# EasyEDA Pro project ProPrj_Arduino_DengDog_2025-10-27.epro

# Schematic Schematic1
Board Name: Board1; Create Date: 2025-10-27; Page Name: P1; Project Name: Arduino_DengDog; Schematic Name: Schematic1; Update Date: 2025-10-27; Company: 嘉立创EDA; Page Size: A2; Version: V1.0
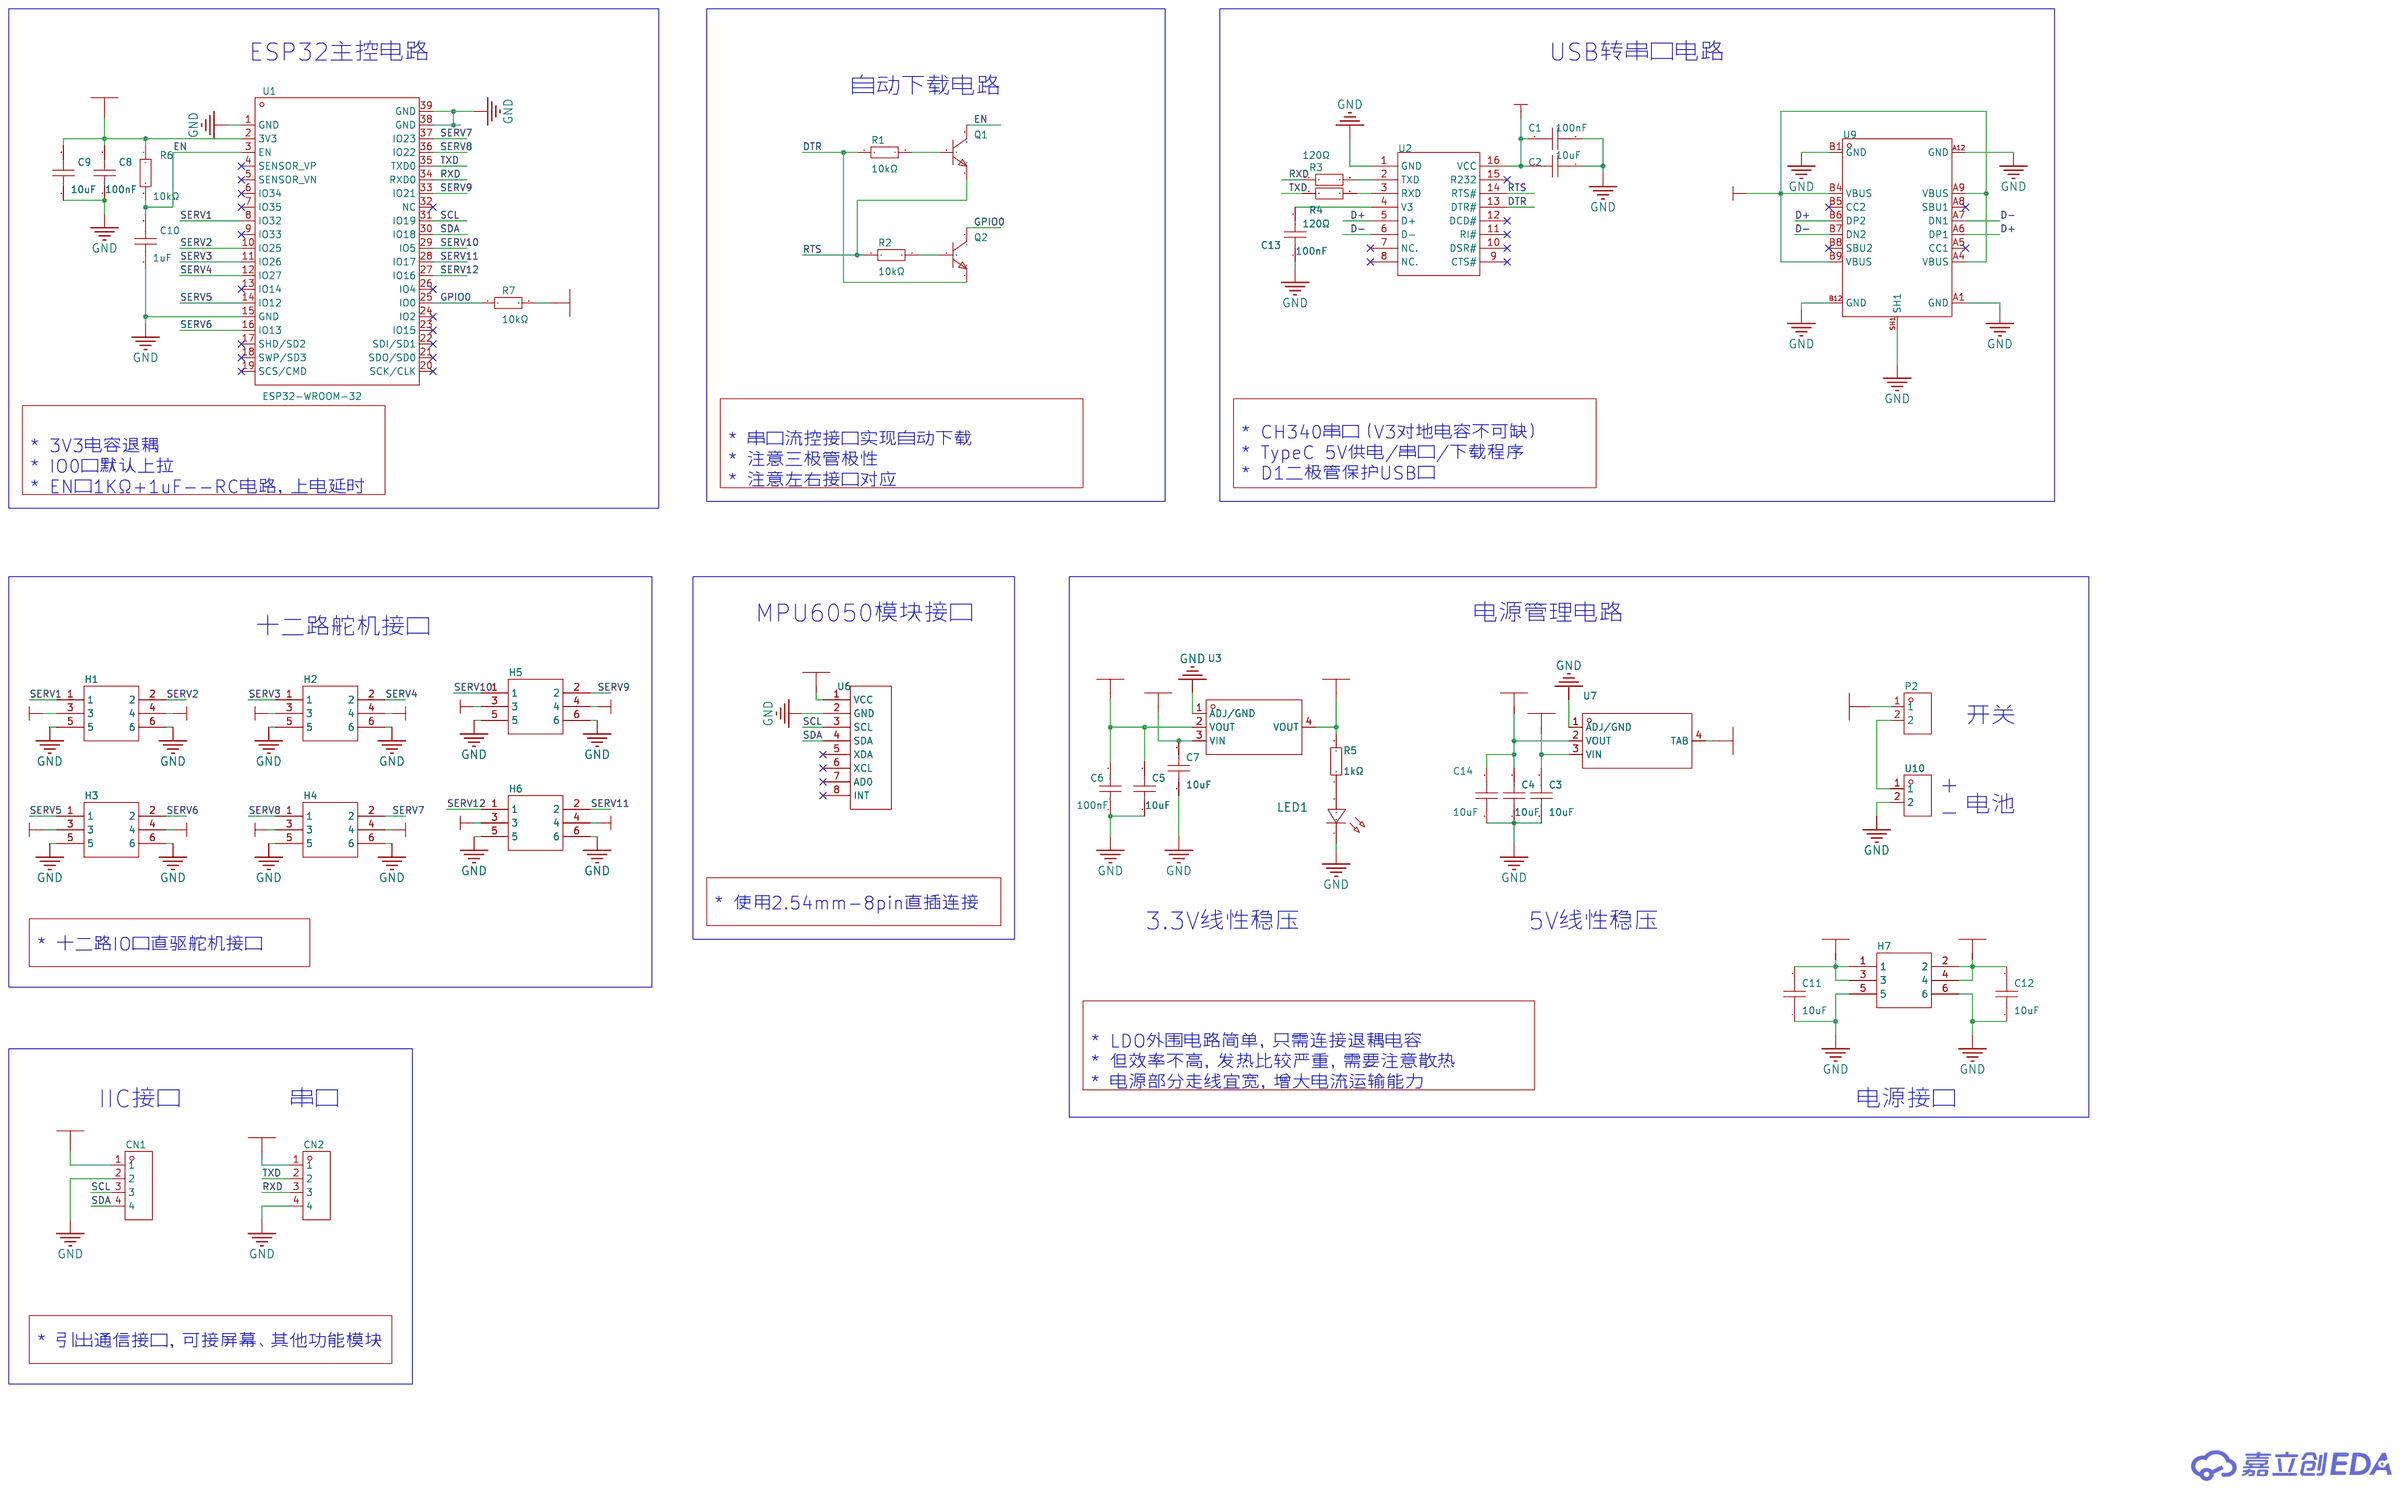
[diagram p0: schematic sheet]

## Parts
C1  100nF  [C0603]
C2  10uF  [C0603]
C3  10uF  [C0603]
C4  10uF  [C0603]
C5  10uF  [C0603]
C6  100nF  [C0603]
C7  10uF  [C0603]
C8  100nF  [C0603]
C9  10uF  [C0603]
C10  1uF  [C0603]
C11  10uF  [C0603]
C12  10uF  [C0603]
C13  100nF  [C0603]
C14  10uF  [C0603]
CN1  A2541WV-4P  [HDR-TH_4P-P2.54-V-M]
CN2  A2541WV-4P  [HDR-TH_4P-P2.54-V-M]
H1  A2541WV-2x3P  [HDR-TH_6P-P2.54-V-R2-C3-S2.54_A2541WV-2X3P]
H2  A2541WV-2x3P  [HDR-TH_6P-P2.54-V-R2-C3-S2.54_A2541WV-2X3P]
H3  A2541WV-2x3P  [HDR-TH_6P-P2.54-V-R2-C3-S2.54_A2541WV-2X3P]
H4  A2541WV-2x3P  [HDR-TH_6P-P2.54-V-R2-C3-S2.54_A2541WV-2X3P]
H5  A2541WV-2x3P  [HDR-TH_6P-P2.54-V-R2-C3-S2.54_A2541WV-2X3P]
H6  A2541WV-2x3P  [HDR-TH_6P-P2.54-V-R2-C3-S2.54_A2541WV-2X3P]
H7  A2541WV-2x3P  [HDR-TH_6P-P2.54-V-R2-C3-S2.54_A2541WV-2X3P]
LED1  19-217/R6C-AL1M2VY/3T  [LED0603-R-RD]
P2  KF301-5.0-2P  [CONN-TH_EK508V-02P]
Q1  2N3904S-RTK/PS  [SOT-23-3_L2.9-W1.3-P1.90-LS2.4-TR]
Q2  2N3904S-RTK/PS  [SOT-23-3_L2.9-W1.3-P1.90-LS2.4-TR]
R1  10kΩ  [R0603]
R2  10kΩ  [R0603]
R3  120Ω  [R0603]
R4  120Ω  [R0603]
R5  1kΩ  [R0603]
R6  10kΩ  [R0603]
R7  10kΩ  [R0603]
U1  ESP32-WROOM-32  [WIFIM-SMD_ESP-32S]
U2  CH340C  [SOP-16_L10.0-W3.9-P1.27-LS6.0-BL]
U3  AMS1117-3.3  [SOT-223-3_L6.5-W3.4-P2.30-LS7.0-BR]
U6  -  [MPU6050]
U7  -  [TO-263-3_L8.6-W10.2-P2.54-LS14.4-TL]
U9  U263-163N-4OS1735  [USB-C-SMD_U263-163N-4GS1735]
U10  KF301-5.0-2P  [CONN-TH_P5.00_KF301-5.0-2P]

## Library data of the parts
C1 C6 C8 C13 = CC0603KRX7R9BB104: 容值:100nF;精度:±10%;额定电压:50V;材质(温度系数):X7R;; LCSC Part Name: 100nF ±10% 50V; Supplier Part: C14663; Manufacturer: YAGEO(国巨); Supplier Footprint: 0603; JLCPCB Part Class: Basic Part; Datasheet: https://atta.szlcsc.com/upload/public/pdf/source/20170116/1484561234239.pdf; Supplier: LCSC; Tolerance: ±10%; Voltage Rated: 50V; Temperature Coefficient: X7R
C2-C5 C7 C9 C11 C12 C14 = CL10A106KP8NNNC: 容值:10uF;精度:±10%;额定电压:10V;材质(温度系数):X5R;; LCSC Part Name: 10uF ±10% 10V; Supplier Part: C19702; Manufacturer: SAMSUNG(三星); Supplier Footprint: 0603; JLCPCB Part Class: Basic Part; Datasheet: https://atta.szlcsc.com/upload/public/pdf/source/20160103/1457707703378.pdf; Supplier: LCSC; Tolerance: ±10%; Voltage Rated: 10V; Temperature Coefficient: X5R
C10 = CL10A105KB8NNNC: 容值:1uF;精度:±10%;额定电压:50V;材质(温度系数):X5R;; LCSC Part Name: 1uF ±10% 50V; Supplier Part: C15849; Manufacturer: SAMSUNG(三星); Supplier Footprint: 0603; JLCPCB Part Class: Basic Part; Datasheet: https://atta.szlcsc.com/upload/public/pdf/source/20160103/1457707679084.pdf; Supplier: LCSC; Tolerance: ±10%; Voltage Rated: 50V; Temperature Coefficient: X5R
CN1 CN2 = A2541WV-4P_1: Supplier Part: C5346656; Manufacturer: CJT(长江连接器); Supplier Footprint: 直插,P=2.54mm; Supplier: LCSC
H1-H7 = A2541WV-2x3P: 间距:2.54mm;总PIN位数:6;排数:2;插针结构:2x3P;行距:2.54mm;安装类型:直插;圆针/方针:方针;额定电流:-;额定电压:-;配合针长度:6mm;塑高:2.54mm;端接针长度:3mm;触头材质:黄铜;触头镀层:-;工作温度范围:-40~+105;颜色:黑色;; LCSC Part Name: 2.54mm 2x3P 直插 方针; Supplier Part: C225518; Manufacturer: CJT(长江连接器); Supplier Footprint: 直插,P=2.54mm; JLCPCB Part Class: Extended Part; Datasheet: https://atta.szlcsc.com/upload/public/pdf/source/20180509/C225518_0BFA6BCCBDAB2EC993D26ADC2A9ADF8C.pdf; Supplier: LCSC; Pitch: 2.54mm; Number of Pins: 6; Number of Rows: 2; Pin Structure: 2x3P; Row Spacing: 2.54mm; Mounting Type: 直插; Circluar Pins/Square Pins: 方针; Length of Mating Pin: 6mm; Insulation Height: 2.54mm; Length of End Connection Pin: 3mm; Contact Material: 黄铜; Operating Temperature Range: -40~+105; Color: 黑色
LED1 = 19-217/R6C-AL1M2VY/3T: 发光颜色:红灯;二极管配置:-;透镜颜色:无色透明;主波长:617.5nm;峰值波长:632nm;色温:-;测试电流:5mA;功率:60mW;发光角度:120°;安装方式:-;工作温度:-40℃~+85℃;; LCSC Part Name: 红灯 617.5nm; Supplier Part: C72044; Manufacturer: EVERLIGHT(亿光); Supplier Footprint: 0603; JLCPCB Part Class: Extended Part; Datasheet: https://atta.szlcsc.com/upload/public/pdf/source/20160507/1462613613821.pdf; Supplier: LCSC; Emitted Color: 红灯; Lens Color: 无色透明; Dominant Wavelength: 617.5nm; Peak Wavelength: 632nm; Forward Current: 5mA; Power Dissipation: 60mW; Viewing Angle: 120°; Operating Temperature: -40℃~+85℃
P2 = KF301-5.0-2P: 间距:5mm;排数:1;每排PIN数:2;安装方式:直针;额定电流:17A;额定电压:250V;线规 - AWG:14~22;线规 - mm?:1.5;工作温度范围:-30℃~+120℃;颜色:蓝色;; LCSC Part Name: 5mm 排数:1 每排P数:2 直针 可拼接 铜 环保; Supplier Part: C474881; Manufacturer: KEFA(科发); Supplier Footprint: 直插,P=5mm; JLCPCB Part Class: Extended Part; Datasheet: https://atta.szlcsc.com/upload/public/pdf/source/20200115/C474881_883EFE2003339C40FD1BEEEFC9A18423.pdf; Supplier: LCSC; Pitch: 5mm; Number of Rows: 1; Number of PINs Per Row: 2; Mounting Style: 直针; Current Rating (Max): 17A; Voltage Rating (Max): 250V; Wire Gauge - AWG: 14~22; Wire Gauge - mm?: 1.5; Operating Temperature Range: -30℃~+120℃; Color: 蓝色
Q1 Q2 = 2N3904S-RTK/PS: 晶体管类型:NPN;集射极击穿电压(Vceo):40V;集电极电流(Ic):200mA;功率(Pd):350mW;集电极截止电流(Icbo):-;集电极-发射极饱和电压(VCE(sat)@Ic,Ib):300mV@50mA,5mA;直流电流增益(hFE@Ic,Vce):100@10mA,1V;特征频率(fT):300MHz;工作温度:+150℃@(Tj);; LCSC Part Name: NPN 40V 200mA; Supplier Part: C18536; Manufacturer: KEC; Supplier Footprint: SOT-23(SOT-23-3); JLCPCB Part Class: Extended Part; Datasheet: https://atta.szlcsc.com/upload/public/pdf/source/20160416/1460799387204.pdf; Supplier: LCSC; Transistor Type: NPN; Collector-Emitter Breakdown Voltage (Vceo): 40V; Collector Current (Ic): 200mA; Power Dissipation (Pd): 350mW; Collector-Emitter Saturation Voltage (VCE(sat)@Ic,Ib): 300mV@50mA,5mA; DC Current Gain (hFE@Ic,Vce): 100@10mA,1V; Transition Frequency (fT): 300MHz; Operating Temperature: +150℃@(Tj); Pin Type: IN
R1 R2 R6 R7 = 0603WAF1002T5E: 电阻类型:厚膜电阻;阻值:10kΩ;精度:±1%;功率:100mW;温度系数:±100ppm/℃;最大工作电压:75V;工作温度范围:-55℃~+155℃;; LCSC Part Name: 10kΩ ±1% 100mW; Supplier Part: C25804; Manufacturer: UNI-ROYAL(厚声); Supplier Footprint: 0603; JLCPCB Part Class: Basic Part; Datasheet: https://atta.szlcsc.com/upload/public/pdf/source/20200306/C422600_1E6D84923E4A46A82E41ADD87F860B5C.pdf; Supplier: LCSC; Type: 厚膜电阻; Tolerance: ±1%; Power(Watts): 100mW; Temperature Coefficient: ±100ppm/℃; Overload Voltage (Max): 75V; Operating Temperature Range: -55℃~+155℃
R3 R4 = 0603WAF1200T5E: 电阻类型:厚膜电阻;阻值:120Ω;精度:±1%;功率:100mW;温度系数:±100ppm/℃;最大工作电压:75V;工作温度范围:-55℃~+155℃;; LCSC Part Name: 120Ω ±1% 100mW; Supplier Part: C22787; Manufacturer: UNI-ROYAL(厚声); Supplier Footprint: 0603; JLCPCB Part Class: Basic Part; Datasheet: https://atta.szlcsc.com/upload/public/pdf/source/20200306/C422600_1E6D84923E4A46A82E41ADD87F860B5C.pdf; Supplier: LCSC; Type: 厚膜电阻; Tolerance: ±1%; Power(Watts): 100mW; Temperature Coefficient: ±100ppm/℃; Overload Voltage (Max): 75V; Operating Temperature Range: -55℃~+155℃
R5 = 0603WAF1001T5E: 电阻类型:厚膜电阻;阻值:1kΩ;精度:±1%;功率:100mW;温度系数:±100ppm/℃;最大工作电压:75V;工作温度范围:-55℃~+155℃;; LCSC Part Name: 1kΩ ±1% 100mW; Supplier Part: C21190; Manufacturer: UNI-ROYAL(厚声); Supplier Footprint: 0603; JLCPCB Part Class: Basic Part; Datasheet: https://atta.szlcsc.com/upload/public/pdf/source/20200306/C422600_1E6D84923E4A46A82E41ADD87F860B5C.pdf; Supplier: LCSC; Type: 厚膜电阻; Tolerance: ±1%; Power(Watts): 100mW; Temperature Coefficient: ±100ppm/℃; Overload Voltage (Max): 75V; Operating Temperature Range: -55℃~+155℃
U1 = ESP32-WROOM-32: Pin Type: IN
U2 = CH340C: 应用功能:Transceiver;接口协议:USB 2.0;数据速率:2Mbps;供电电压:3.3V；5V;; Supplier Part: C84681; Manufacturer: WCH(南京沁恒); Supplier Footprint: SOP-16; JLCPCB Part Class: Extended Part; Datasheet: https://atta.szlcsc.com/upload/public/pdf/source/20200819/C84681_ADBED554CE321879DBD6B1D06488689C.pdf; Supplier: LCSC; Applications Function: Transceiver; Protocol: USB 2.0; Data Rate: 2Mbps; Supply Voltage: 3.3V；5V; Pin Type: IN
U3 = AMS1117-3.3_C6186: 输出类型:固定;输出极性:正;输出通道数:1;最大输入电压:-;输出电压:3.3V;压差:1.3V@(800mA);静态电流(地电流):-;输出电流:1A;电源纹波抑制比(PSRR):72dB@(120Hz);噪声:-;特性:-;工作温度:-;; LCSC Part Name: 正 Vout=3.3V 1A 72dB@(120Hz); Supplier Part: C6186; Manufacturer: AMS; Supplier Footprint: SOT-223-3; JLCPCB Part Class: Basic Part; Datasheet: https://atta.szlcsc.com/upload/public/pdf/source/20180727/C6186_7A095716F0823C02F1997A905E26C086.pdf; Supplier: LCSC; Output Type: 固定; Output Polarity: 正; Number of Outputs: 1; Output Voltage: 3.3V; Dropout Voltage: 1.3V@(800mA); Output Current: 1A; Power Supply Rejection Ratio (PSRR): 72dB@(120Hz); Pin Type: IN
U6 = MPU6050
U7 = LM1084S-5.0/TR: 输出类型:固定;输出极性:正;输出通道数:1;最大输入电压:12V;输出电压:5V;压差:1.5V@(5A);输出电流:5A;电源纹波抑制比(PRSS):72dB@(120Hz);; LCSC Part Name: Vin=12V Vout=5V 5A 72dB@(120Hz); Supplier Part: C259973; Manufacturer: HGSEMI(华冠); Supplier Footprint: TO-263-3L; JLCPCB Part Class: Extended Part; Datasheet: https://atta.szlcsc.com/upload/public/pdf/source/20181026/C259973_D4A8C77477BC653F2A46298C4B478943.pdf; Supplier: LCSC; Output Type: 固定; Output Polarity: 正; Number of Outputs: 1; Maximum Input Voltage: 12V; Output Voltage: 5V; Dropout Voltage: 1.5V@(5A); Output Current: 5A; Power Supply Rejection Ratio (PRSS): 72dB@(120Hz)
U9 = U263-163N-4OS1735: 连接器类型:Type-C;标准:USB 3.1;公母:母座;触点数量:16;端口数量:1;安装方式:卧贴;额定电流 - 电源:5A;触头材质:铜合金;触头镀层:金;工作温度范围:-25℃~+85℃;焊接温度(最大值):260℃;; LCSC Part Name: Type-C 母座 卧贴; Supplier Part: C2931472; Manufacturer: XKB Connectivity(中国星坤); Supplier Footprint: SMD; JLCPCB Part Class: Extended Part; Datasheet: https://atta.szlcsc.com/upload/public/pdf/source/20211215/D777AAC9FA67A227A25094451B68E75F.pdf; Supplier: LCSC; Connector Type: Type-C; Standard: USB 3.1; Gender: 母座; Number of Contacts: 16; Number of Ports: 1; Mounting Style: 卧贴; Current Rating - Power (Max): 5A; Contact Material: 铜合金; Contact Plating: 金; Operating Temperature Range: -25℃~+85℃; Welding Temperature (Max): 260℃
U10 = KF301-5.0-2P: 间距:5mm;排数:1;每排PIN数:2;安装方式:直针;额定电流:17A;额定电压:250V;线规 - AWG:14~22;线规 - mm?:1.5;工作温度范围:-30~+120;颜色:蓝色;; LCSC Part Name: 5mm 排数:1 每排P数:2 直针 可拼接 铜 环保; Supplier Part: C474881; Manufacturer: KEFA(科发); Supplier Footprint: 直插,P=5mm; JLCPCB Part Class: Extended Part; Datasheet: https://atta.szlcsc.com/upload/public/pdf/source/20200115/C474881_883EFE2003339C40FD1BEEEFC9A18423.pdf; Supplier: LCSC; Pitch: 5mm; Number of Rows: 1; Number of PINs Per Row: 2; Mounting Style: 直针; Current Rating (Max): 17A; Voltage Rating (Max): 250V; Wire Gauge - AWG: 14~22; Wire Gauge - mm?: 1.5; Operating Temperature Range: -30~+120; Color: 蓝色

## Nets
3V3: C5.2 C6.2 C8.2 C9.2 C11.2 CN1.1 H7.1 H7.3 R5.2 R6.1 R7.2 U1.2(3V3) U3.2(VOUT) U3.4(VOUT) U6.1(VCC)
5VIN: C1.1 C2.1 C4.2 C7.2 C12.2 C14.2 CN2.1 H1.3 H1.4 H2.3 H2.4 H3.3 H3.4 H4.3 H4.4 H5.3 H5.4 H6.3 H6.4 H7.2 H7.4 U2.16(VCC) U3.3(VIN) U7.2(VOUT) U7.4(TAB) U9.A4(VBUS) U9.A9(VBUS) U9.B4(VBUS) U9.B9(VBUS)
GND: C1.2 C2.2 C3.1 C4.1 C5.1 C6.1 C7.1 C8.1 C9.1 C10.1 C11.1 C12.1 C13.1 C14.1 CN1.2 CN2.4 H1.5 H1.6 H2.5 H2.6 H3.5 H3.6 H4.5 H4.6 H5.5 H5.6 H6.5 H6.6 H7.5 H7.6 LED1.1(C) U1.1(GND) U1.15(GND) U1.38(GND) U1.39(GND) U2.1(GND) U3.1(ADJ/GND) U6.2(GND) U7.1(ADJ/GND) U9.A1(GND) U9.A12(GND) U9.B1(GND) U9.B12(GND) U9.SH1 U10.2
VIN: C3.2 P2.1 U7.3(VIN)
D+: U2.5(D+) U9.A6(DP1) U9.B6(DP2)
D-: U2.6(D-) U9.A7(DN1) U9.B7(DN2)
DTR: Q2.1(E) R1.1 U2.13(DTR#)
EN: C10.2 Q1.3(C) R6.2 U1.3(EN)
GPIO0: Q2.3(C) R7.1 U1.25(IO0)
RTS: Q1.1(E) R2.1 U2.14(RTS#)
RXD: CN2.3 R3.1 U1.34(RXD0)
SCL: CN1.3 U1.31(IO19) U6.3(SCL)
SDA: CN1.4 U1.30(IO18) U6.4(SDA)
SERV1: H1.1 U1.8(IO32)
SERV2: H1.2 U1.10(IO25)
SERV3: H2.1 U1.11(IO26)
SERV4: H2.2 U1.12(IO27)
SERV5: H3.1 U1.14(IO12)
SERV6: H3.2 U1.16(IO13)
SERV7: H4.2 U1.37(IO23)
SERV8: H4.1 U1.36(IO22)
SERV9: H5.2 U1.33(IO21)
SERV10: H5.1 U1.29(IO5)
SERV11: H6.2 U1.28(IO17)
SERV12: H6.1 U1.27(IO16)
TXD: CN2.2 R4.1 U1.35(TXD0)
$1N3534: Q1.2(B) R1.2
$1N3535: Q2.2(B) R2.2
$1N3564: R3.2 U2.2(TXD)
$1N3565: R4.2 U2.3(RXD)
$1N3570: C13.2 U2.4(V3)
Net-(LED1-2): LED1.2(A) R5.1
Net-(P2-2): P2.2 U10.1

Not connected (* = marked no-connect by the designer): U1 4(SENSOR_VP)* 5(SENSOR_VN)* 6(IO34)* 7(IO35)* 9(IO33)* 13(IO14)* 17(SHD/SD2)* 18(SWP/SD3)* 19(SCS/CMD)* 20(SCK/CLK)* 21(SDO/SD0)* 22(SDI/SD1)* 23(IO15)* 24(IO2)* 26(IO4)* 32(NC)*; U2 7(NC.)* 8(NC.)* 9(CTS#)* 10(DSR#)* 11(RI#)* 12(DCD#)* 15(R232)*; U6 5(XDA)* 6(XCL)* 7(AD0)* 8(INT)*; U9 A5(CC1)* A8(SBU1)* B5(CC2)* B8(SBU2)*

## Notes on the sheet
- ESP32主控电路
- USB转串口电路
- 自动下载电路
- * 串口流控接口实现自动下载
  * 注意三极管极性
  * 注意左右接口对应
- * CH340串口（V3对地电容不可缺）
  * TypeC 5V供电/串口/下载程序
  * D1二极管保护USB口
- * 3V3电容退耦
  * IO0口默认上拉
  * EN口1KΩ+1uF--RC电路，上电延时
- MPU6050模块接口
- 电源管理电路
- 十二路舵机接口
- 开关
- +
- -
- 电池
- * 使用2.54mm-8pin直插连接
- 3.3V线性稳压
- 5V线性稳压
- * 十二路IO口直驱舵机接口
- * LDO外围电路简单，只需连接退耦电容
  * 但效率不高，发热比较严重，需要注意散热
  * 电源部分走线宜宽，增大电流运输能力
- IIC接口
- 串口
- 电源接口
- * 引出通信接口，可接屏幕、其他功能模块

# Board PCB1
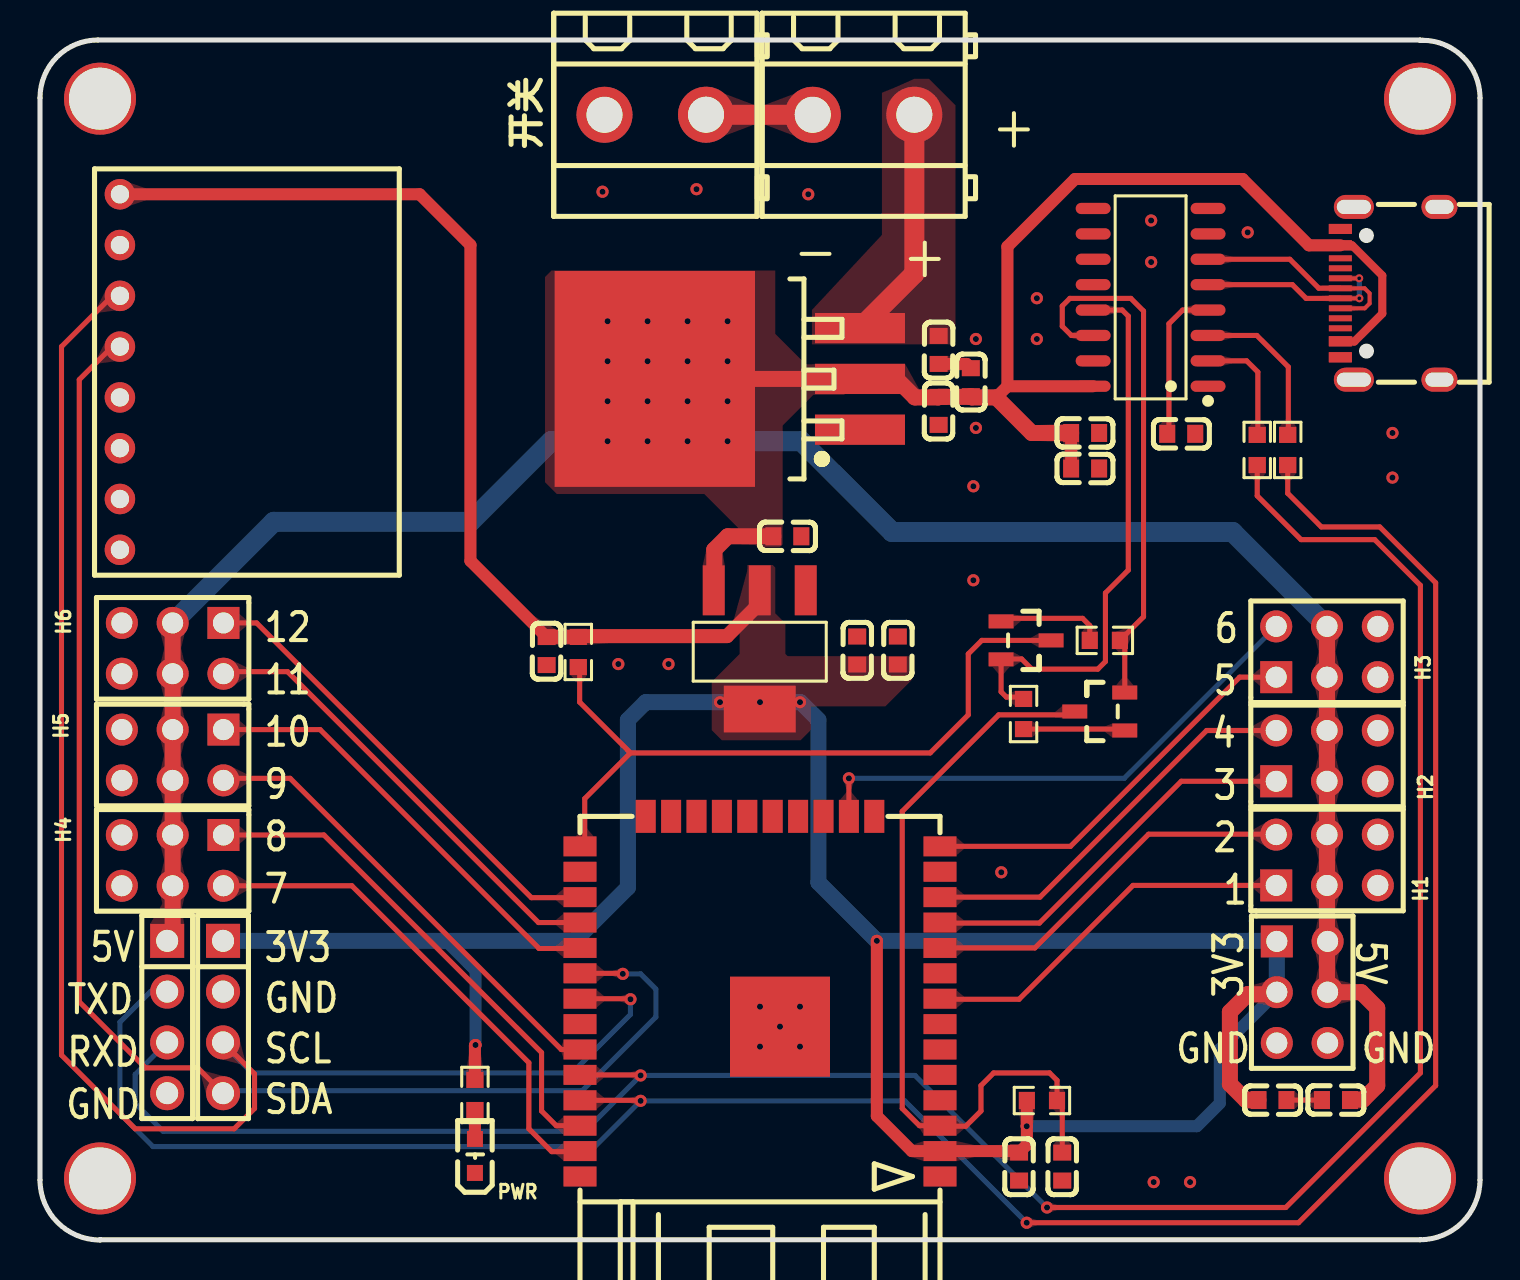
[diagram p1: board, top side]
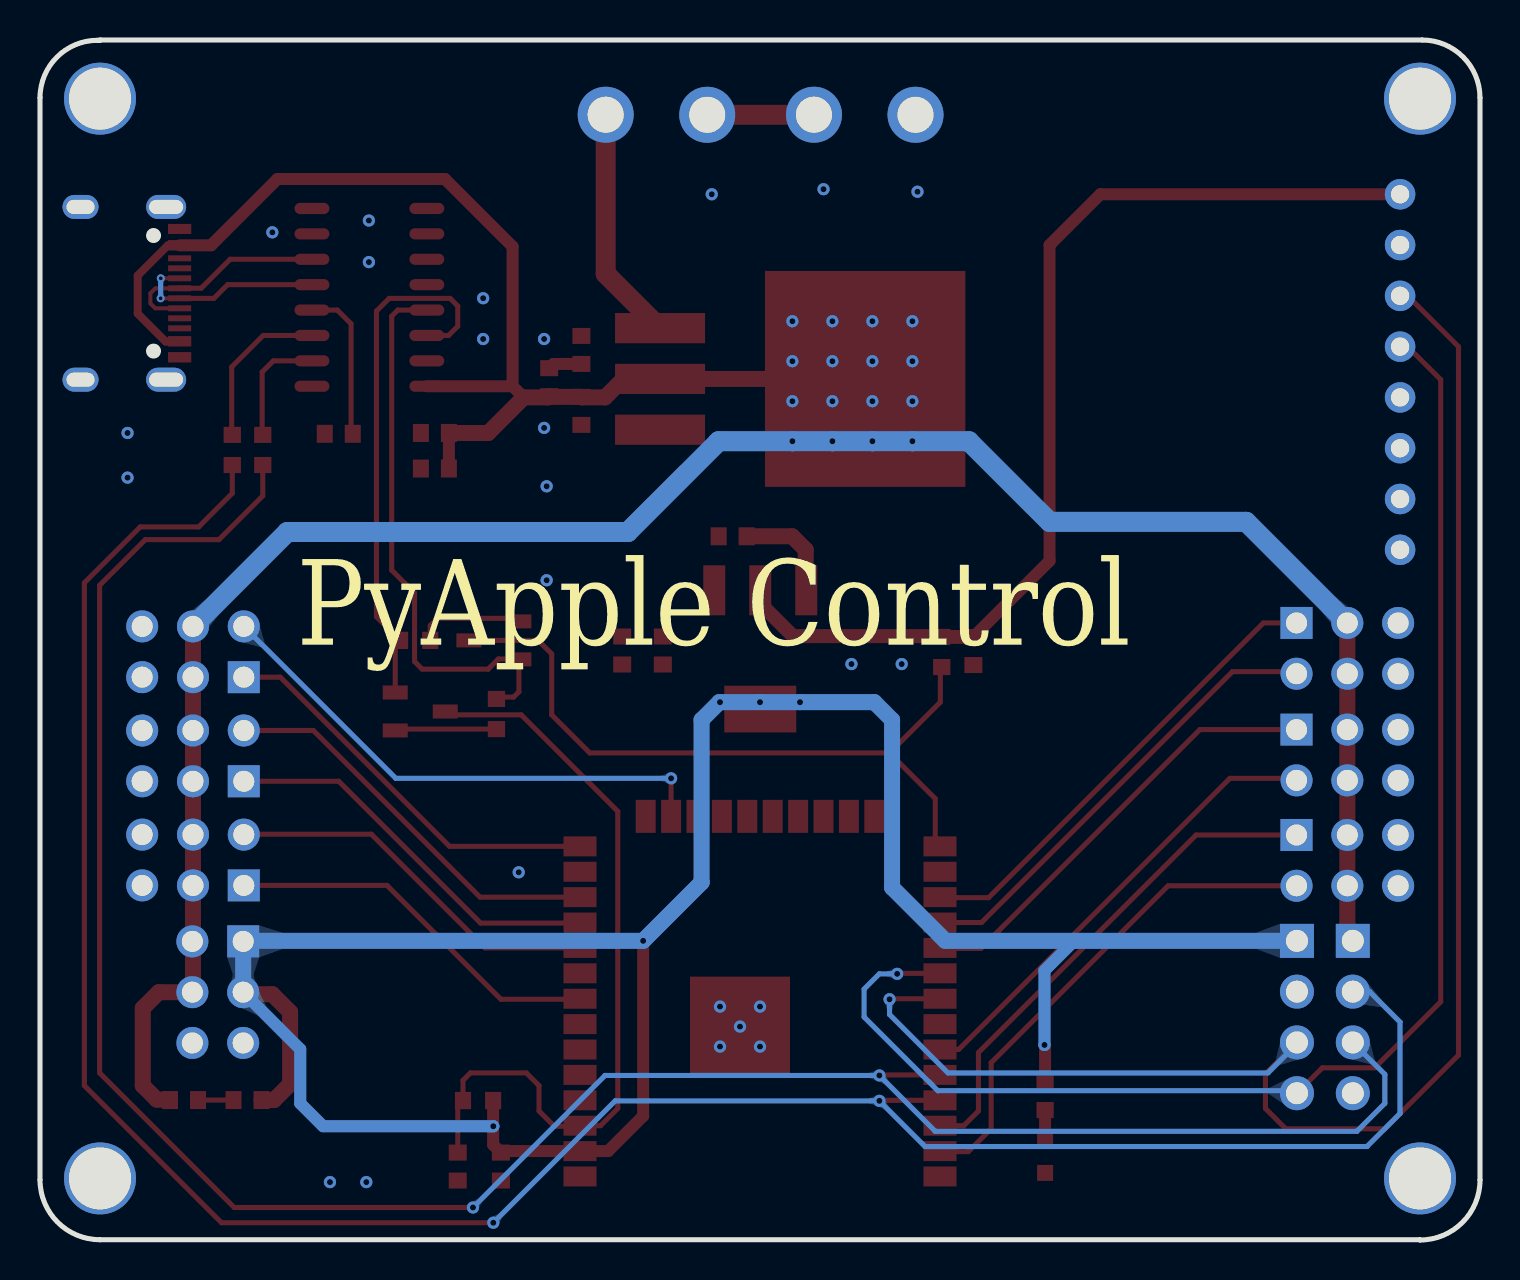
[diagram p2: board, bottom side, seen from below]

Outline 72 x 60.01 mm; copper layers: Top Layer, Bottom Layer. Coordinates in mm from the lower left corner of the outline.
Outline path: 0,57.12 arc(0.85,59.17) 2.89,60.01 68.98,60.01 arc(69,60.01) 69,60 69.12,60 arc(71.16,59.16) 72,57.12 72,3.01 arc(71.12,0.89) 69,0.01 3.01,0.01 arc(3,0.01) 3,0 arc(0.88,0.88) 0,3 0,57.12
Stack: Top Layer 0.035mm / Dielectric1 1.51mm FR4 er 4.5 / Bottom Layer 0.035mm

## Design rules (mm)
spacing safeClearance (default): track to track 0.152, other pairs 0.152 to 0.3
track width trackWidth (default): min 0.127, default 0.254, max 2.54
differential pair differentialPair (default): width min 0.127, default 0.254, max 2.54; gap min 0.152, default 0.152
via viaSize (default): diameter min 0.4, default 0.61, max 10; hole min 0.2, default 0.305, max 6

## Placement (name value [footprint] x y rotation side)
C1  100nF  [C0603]  52.26 40.36 0 top
C2  10uF  [C0603]  52.26 38.58 0 top
C3  10uF  [C0603]  44.93 44.51 90 top
C4  10uF  [C0603]  44.93 41.47 90 top
C5  10uF  [C0603]  40.86 29.48 270 top
C6  100nF  [C0603]  42.89 29.48 270 top
C7  10uF  [C0603]  37.37 35.19 180 top
C8  100nF  [C0603]  48.95 3.67 90 top
C9  10uF  [C0603]  25.33 29.45 90 top
C10  1uF  [C0603]  51.11 3.67 90 top
C11  10uF  [C0603]  61.62 7 180 top
C12  10uF  [C0603]  64.8 7 0 top
C13  100nF  [C0603]  57.06 40.32 180 top
C14  10uF  [C0603]  46.54 42.9 270 top
CN1  A2541WV-4P  [HDR-TH_4P-P2.54-V-M]  9.15 11.15 270 top
CN2  A2541WV-4P  [HDR-TH_4P-P2.54-V-M]  6.36 11.15 270 top
H1  A2541WV-2x3P  [HDR-TH_6P-P2.54-V-R2-C3-S2.54_A2541WV-2X3P]  64.35 19 0 top
H2  A2541WV-2x3P  [HDR-TH_6P-P2.54-V-R2-C3-S2.54_A2541WV-2X3P]  64.35 24.21 0 top
H3  A2541WV-2x3P  [HDR-TH_6P-P2.54-V-R2-C3-S2.54_A2541WV-2X3P]  64.35 29.42 0 top
H4  A2541WV-2x3P  [HDR-TH_6P-P2.54-V-R2-C3-S2.54_A2541WV-2X3P]  6.63 18.99 180 top
H5  A2541WV-2x3P  [HDR-TH_6P-P2.54-V-R2-C3-S2.54_A2541WV-2X3P]  6.63 24.26 180 top
H6  A2541WV-2x3P  [HDR-TH_6P-P2.54-V-R2-C3-S2.54_A2541WV-2X3P]  6.63 29.59 180 top
H7  A2541WV-2x3P  [HDR-TH_6P-P2.54-V-R2-C3-S2.54_A2541WV-2X3P]  63.11 12.39 270 top
NOREF  -  [Pad_e243]  69 3.08 0 top
NOREF#2  -  [Pad_e244]  3 57.08 0 top
NOREF#3  -  [Pad_e245]  69 57.08 0 top
NOREF#4  -  [Pad_e241]  3 3.08 0 top
P1  EK508V-02P  [CONN-TH_EK508V-02P]  30.76 56.28 180 top
P2  KF301-5.0-2P  [CONN-TH_EK508V-02P]  41.18 56.28 180 top
PWR  19-217/R6C-AL1M2VY/3T  [LED0603-R-RD]  21.75 4.21 90 top
Q1  2N3904S-RTK/PS  [SOT-23-3_L2.9-W1.3-P1.90-LS2.4-TR]  52.99 26.43 0 top
Q2  2N3904S-RTK/PS  [SOT-23-3_L2.9-W1.3-P1.90-LS2.4-TR]  49.31 29.99 180 top
R1  10kΩ  [R0603]  49.18 26.31 270 top
R2  10kΩ  [R0603]  53.24 29.99 180 top
R3  120Ω  [R0603]  60.86 39.51 90 top
R4  120Ω  [R0603]  62.39 39.51 90 top
R5  1kΩ  [R0603]  21.75 7.25 90 top
R6  10kΩ  [R0603]  50.1 6.98 0 top
R7  10kΩ  [R0603]  26.91 29.41 90 top
U1  ESP32-WROOM-32  [WIFIM-SMD_ESP-32S]  36 12.18 90 top
U2  CH340C  [SOP-16_L10.0-W3.9-P1.27-LS6.0-BL]  55.53 47.14 90 top
U3  AMS1117-3.3  [SOT-223-3_L6.5-W3.4-P2.30-LS7.0-BR]  35.99 29.52 90 top
U6  -  [MPU6050]  4 52.3 0 top
U7  -  [TO-263-3_L8.6-W10.2-P2.54-LS14.4-TL]  35.87 43.06 180 top
U9  U263-163N-4OS1735  [USB-C-SMD_U263-163N-4GS1735]  67.5 47.35 90 top

## Footprints (pads in the part's own frame, mm; a bottom-side part is the same pattern mirrored in y, then rotated)
C0603
  rect 0.8x0.9 smd: 1(-0.7,0) 2(0.7,0)
CONN-TH_EK508V-02P
  round 2.8 hole 1.8: 1(-2.538,-0.002) 2(2.538,0.002)
HDR-TH_4P-P2.54-V-M
  rect 1.7x1.7 hole 1.1: 1(-3.81,0)
  round 1.7 hole 1.1: 2(-1.27,0) 3(1.27,0) 4(3.81,0)
HDR-TH_6P-P2.54-V-R2-C3-S2.54_A2541WV-2X3P
  rect 1.6x1.6 hole 1.05: 1(-2.54,-1.27)
  round 1.6 hole 1.05: 2(-2.54,1.27) 3(0,-1.27) 4(0,1.27) 5(2.54,-1.27) 6(2.54,1.27)
LED0603-R-RD
  rect 0.8x0.8 smd: 1(0.851,0) 2(-0.851,0)
MPU6050
  round 1.524 hole 0.914: 1(0,0) 2(0,-2.54) 3(0,-5.08) 4(0,-7.62) 5(0,-10.16) 6(0,-12.7) 7(0,-15.24) 8(0,-17.78)
Pad_e241
  round 3.6 hole 3.1: 1(0,0)
Pad_e243
  round 3.6 hole 3.1: 1(0,0)
Pad_e244
  round 3.6 hole 3.1: 1(0,0)
Pad_e245
  round 3.6 hole 3.1: 1(0,0)
R0603
  rect 0.806x0.864 smd: 1(-0.753,0) 2(0.753,0)
SOP-16_L10.0-W3.9-P1.27-LS6.0-BL
  oval 0.56x1.745 smd: 1(-4.445,-2.873) 2(-3.175,-2.873) 3(-1.905,-2.873) 4(-0.635,-2.873) 5(0.635,-2.873) 6(1.905,-2.873) 7(3.175,-2.873) 8(4.445,-2.873) 9(4.445,2.873) 10(3.175,2.873) 11(1.905,2.873) 12(0.635,2.873) 13(-0.635,2.873) 14(-1.905,2.873) 15(-3.175,2.873) 16(-4.445,2.873)
SOT-23-3_L2.9-W1.3-P1.90-LS2.4-TR
  rect 1.25x0.7 smd: 1(1.25,0.95) 2(1.25,-0.95) 3(-1.25,0)
SOT-223-3_L6.5-W3.4-P2.30-LS7.0-BR
  rect 2.5x1.1 smd: 1(2.97,-2.3) 2(2.97,0) 3(2.97,2.3)
  rect 2.34x3.6 smd: 4(-2.97,0)
TO-263-3_L8.6-W10.2-P2.54-LS14.4-TL
  rect 4.501x1.512 smd: 1(-5.128,2.54) 2(-5.128,0) 3(-5.128,-2.54)
  rect 10.021x10.8 smd: 4(5.128,0)
USB-C-SMD_U263-163N-4GS1735
  rect 0.5x1.15 smd: A1(-3.2,2.478) A4(-2.4,2.478) A9(2.4,2.478) A12(3.219,2.478) B1(3.219,2.478) B4(2.4,2.478) B9(-2.4,2.478) B12(-3.2,2.478)
  rect 0.3x1.15 smd: A5(-1.25,2.478) A6(-0.25,2.478) A7(0.25,2.478) A8(1.25,2.478) B5(1.75,2.478) B6(0.75,2.478) B7(-0.75,2.478) B8(-1.75,2.478)
  oval 1.2x2 hole 0.7x1.7: SH1(-4.32,1.802) SH1(4.32,1.802)
  oval 1.2x1.8 hole 0.7x1.4: SH1(-4.32,-2.478) SH1(4.32,-2.478)
WIFIM-SMD_ESP-32S
  rect 1x1.65 smd: 1(-9.005,-9) 2(-7.735,-9) 3(-6.465,-9) 4(-5.195,-9) 5(-3.925,-9) 6(-2.655,-9) 7(-1.385,-9) 8(-0.115,-9) 9(1.155,-9) 10(2.425,-9) 11(3.695,-9) 12(4.965,-9) 13(6.235,-9) 14(7.505,-9) 25(7.505,9) 26(6.235,9) 27(4.965,9) 28(3.695,9) 29(2.425,9) 30(1.155,9) 31(-0.115,9) 32(-1.385,9) 33(-2.655,9) 34(-3.925,9) 35(-5.195,9) 36(-6.465,9) 37(-7.735,9) 38(-9.005,9)
  rect 1.65x1 smd: 15(9.005,-5.715) 16(9.005,-4.445) 17(9.005,-3.175) 18(9.005,-1.905) 19(9.005,-0.635) 20(9.005,0.635) 21(9.005,1.905) 22(9.005,3.175) 23(9.005,4.445) 24(9.005,5.715)
  rect 5x5 smd: 39(-1.51,-1)

## Nets
As in the schematic, except:
GND: C1.2 C2.2 C3.1 C4.1 C5.1 C6.1 C7.1 C8.1 C9.1 C10.1 C11.1 C12.1 C13.1 C14.1 CN1.2 CN2.4 H1.5 H1.6 H2.5 H2.6 H3.5 H3.6 H4.5 H4.6 H5.5 H5.6 H6.5 H6.6 H7.5 H7.6 P1.2 PWR.2 U1.1 U1.15 U1.38 U1.39 U2.1 U3.1 U6.2 U7.1 U9.A1 U9.A12 U9.B1 U9.B12 U9.SH1
$1N5940: PWR.1 R5.1
$1N5951: P1.1 P2.2

Pads without a net: NOREF 1; NOREF#2 1; NOREF#3 1; NOREF#4 1; U1 4 5 6 7 9 13 17 18 19 20 21 22 23 24 26 32; U2 7 8 9 10 11 12 15; U6 5 6 7 8; U9 A5 A8 B5 B8

## Via types
v1: diameter 0.61, hole 0.305, Top Layer to Bottom Layer, 53 vias
v2: diameter 0.4, hole 0.2, Top Layer to Bottom Layer, 2 vias

## Routing (per net, layer and track width the routed paths; a pad name or vN(x,y) marks a point on that pad's centre or on a via; arc(x,y) is an arc through that point)
3V3: length 178.5
  Top Layer w0.6: U6.1 18.98,52.3 21.52,49.76 21.52,33.96 C9.2 ; R5.2 21.75,9.72 v1(21.78,9.75) ; v1(41.84,14.96) 41.84,6.2 43.59,4.45 U1.2 48.88,4.45 C8.2 49.34,4.76 R6.1
  Top Layer w0.7: C9.2 25.34,30.16 R7.2 26.95,30.2 34.35,30.2 36.13,31.98 36.13,32.22 35.99,32.36
  Top Layer w0.8: C11.2 60.29,7 59.5,7.8 59.5,11.41 60.38,12.29 61.74,12.29 H7.3
  Bottom Layer w0.6: 20.29,14.96 21.78,13.47 v1(21.78,9.75) ; v1(49.34,5.69) 57.84,5.69 58.99,6.83 58.99,9.54 H7.3
  Bottom Layer w0.8: H7.3 H7.1 61.81,14.96 v1(41.84,14.96) 38.92,17.88 38.92,26.01 38.03,26.9 v1(36,26.9) v1(34,26.9) 30.28,26.9 29.4,26.01 29.4,17.63 26.73,14.96 9.15,14.96
  vias: v1(38,26.9)
5VIN: length 175.9
  Top Layer w0.4: U9.A4 65.03,44.93 65.72,44.93 67.12,46.33 67.12,48.24 65.6,49.75 U9.A9
  Top Layer w0.6: 51.56,40.36 51.56,38.58 ; U9.A9 63.44,49.75 60.13,53.06 51.75,53.06 48.37,49.68 48.37,42.7 ; 48.37,42.7 47.81,42.14 ; 48.37,42.7 U2.16
  Top Layer w0.8: C7.2 34.39,35.19 33.71,34.52 33.71,32.39 33.69,32.36 ; H3.4 H3.3 H2.4 H2.3 H1.4 H1.3 64.35,12.42 H7.4 66.06,12.39 66.86,11.59 66.86,7.72 66.16,7.02 65.52,7.02 C12.2 ; 51.56,40.36 49.59,40.36 47.81,42.14 46.6,42.14 C14.2 46.51,42.17 C4.2 44.91,42.14 43.75,42.14 42.82,43.06 U7.2 U7.4 ; H6.3 H6.4 H5.3 H5.4 H4.3 H4.4 6.63,15.24 6.36,14.96
  Bottom Layer w1: H6.3 11.69,35.92 21.52,35.92 25.56,39.95 v1(28.38,39.95) v1(30.38,39.95) v1(32.38,39.95) v1(34.38,39.95) 38.06,39.95 42.6,35.41 59.63,35.41 H3.4
  vias: v1(28.38,45.95) v1(28.38,43.95) v1(28.38,41.95) v1(30.38,45.95) v1(30.38,43.95) v1(30.38,41.95) v1(32.38,45.95) v1(32.38,43.95) v1(32.38,41.95) v1(34.38,45.95) v1(34.38,43.95) v1(34.38,41.95)
GND: length 3.5
  Top Layer w0.254: C11.1 C12.1
  Top Layer w0.6: C3.1 46.33,43.81 C14.1
  vias: v1(28.13,52.43) v1(28.92,28.8) v1(31.43,28.8) v1(32.82,52.55) v1(36,11.67) v1(36,9.67) v1(37,10.67) v1(38,11.67) v1(38,9.67) v1(38.41,52.3) v1(46.67,37.69) v1(46.67,33) v1(46.79,45.06) v1(46.79,40.62) v1(48.06,18.39) v1(49.84,47.1) v1(49.84,45.06) v1(55.56,50.99) v1(55.56,48.91) v1(55.69,2.9) v1(57.5,2.9) v1(60.38,50.39) v1(67.62,40.36) v1(67.62,38.13)
VIN: length 11.8
  Top Layer w1: U7.3 43.72,48.32 P2.1
D+: length 9.8
  Top Layer w0.2: U9.B6 v2(65.96,48.1) 65.97,48.11 ; 65.97,47.09 v2(65.97,47.1) U9.A6
  Top Layer w0.254: U9.A6 65.01,47.09 63.31,47.09 62.62,47.78 U2.5
  Bottom Layer w0.254: v2(65.97,47.1) 65.97,48.09 v2(65.96,48.1)
D-: length 10.9
  Top Layer w0.2: U9.A7 66.23,47.6 66.48,47.35 66.48,46.84 66.24,46.6 U9.B7
  Top Layer w0.254: U2.6 62.49,49.05 63.94,47.6 65.01,47.6 U9.A7
DTR: length 28.1
  Top Layer w0.254: U2.13 54.11,46.51 54.41,46.2 54.41,33.5 53.27,32.36 53.27,28.93 52.89,28.55 49.59,28.55 49.08,29.06 48.08,29.06 Q2.1 48.06,27.42 48.32,27.15 49.08,27.15 R1.1
EN: length 39.4
  Top Layer w0.254: Q1.3 51.57,26.26 47.94,26.26 43.11,21.44 43.11,6.58 43.97,5.72 U1.3 45.03,5.69 46.29,5.69 47.05,6.45 47.05,7.72 47.68,8.36 50.48,8.36 50.85,7.98 R6.2 51.11,6.71 C10.2
GPIO0: length 36.2
  Top Layer w0.254: R7.1 26.98,28.59 26.98,26.9 29.52,24.36 ; 29.52,24.36 27.24,22.07 27.24,19.92 U1.25 ; 29.52,24.36 44.51,24.36 46.41,26.26 46.41,29.31 47.09,29.99 Q2.3
RTS: length 26.9
  Top Layer w0.254: U2.14 51.57,45.24 51.11,45.7 51.11,46.71 51.49,47.09 54.54,47.09 55.18,46.46 55.18,31.17 R2.1 54.24,29.75 Q1.1
RXD: length 114.2
  Top Layer w0.254: U1.34 30,8.26 v1(30.03,8.23) ; R3.1 60.86,37.22 63.05,35.03 66.73,35.03 69.02,32.74 69.02,8.36 62.29,1.63 v1(50.35,1.63)
  Bottom Layer w0.254: v1(50.35,1.63) 43.75,8.23 v1(30.03,8.23) 27.24,5.44 6.16,5.44 4.76,6.83 4.76,8.28 6.36,9.88
SCL: length 80.5
  Top Layer w0.254: 9.15,9.88 10.73,8.31 10.73,6.58 9.71,5.56 4.76,5.56 1.07,9.25 1.07,44.68 3.61,47.22 U6.3 ; U1.31 29.5,12.07 v1(29.52,12.04)
  Bottom Layer w0.254: 9.15,9.88 9.15,9.8 10.6,8.36 26.6,8.36 29.52,11.28 v1(29.52,12.04)
SDA: length 71.6
  Top Layer w0.254: U6.4 3.61,44.68 1.96,43.03 1.96,11.91 5.27,8.61 7.88,8.61 CN1.4 ; v1(29.14,13.31) 29.11,13.34 U1.30
  Bottom Layer w0.254: CN1.4 9.28,7.47 27.11,7.47 30.79,11.15 30.79,12.55 30.03,13.31 v1(29.14,13.31)
SERV1: length 19.2
  Top Layer w0.254: H1.1 54.65,17.73 48.95,12.04 45.03,12.04 U1.8
SERV2: length 19.2
  Top Layer w0.254: H1.2 61.79,20.3 55.43,20.3 49.74,14.61 U1.10
SERV3: length 19.8
  Top Layer w0.254: U1.11 45.03,15.85 49.97,15.85 57.06,22.94 H2.1
SERV4: length 20.3
  Top Layer w0.254: H2.2 58.33,25.48 50,17.15 U1.12
SERV5: length 20.3
  Top Layer w0.254: U1.14 51.52,19.69 59.98,28.15 H3.1
SERV6: length 26.4
  Top Layer w0.254: U1.16 v1(40.44,23.09)
  Bottom Layer w0.254: v1(40.44,23.09) 54.21,23.09 H3.2
SERV7: length 25.3
  Top Layer w0.254: H4.2 15.59,17.72 24.44,8.87 24.44,5.56 25.59,4.42 26.97,4.42 U1.37
SERV8: length 25.6
  Top Layer w0.254: H4.1 14.19,20.26 25.08,9.37 25.08,6.45 25.81,5.72 U1.36
SERV9: length 23.5
  Top Layer w0.254: U1.33 26.07,9.53 12.5,23.09 9.28,23.09 H5.2
SERV10: length 22.4
  Top Layer w0.254: U1.29 26.97,14.58 24.95,14.58 14,25.53 H5.1
SERV11: length 23.1
  Top Layer w0.254: H6.2 9.28,28.42 12.38,28.42 24.92,15.88 U1.28
SERV12: length 23.5
  Top Layer w0.254: H6.1 10.83,30.86 24.57,17.12 26.97,17.12 U1.27
TXD: length 119.2
  Top Layer w0.254: v1(49.34,0.86) 62.92,0.86 69.78,7.72 69.78,32.87 66.99,35.66 64.07,35.66 62.39,37.34 R4.1 ; v1(30.03,6.96) 30,6.99 U1.35
  Bottom Layer w0.254: CN2.2 5.52,12.42 4,10.9 4,6.33 5.65,4.67 27.75,4.67 v1(30.03,6.96) 43.24,6.96 v1(49.34,0.86)
$1N3534: length 5.1
  Top Layer w0.254: Q1.2 54.17,25.55 R1.2
$1N3535: length 5.4
  Top Layer w0.254: Q2.2 48.21,31.09 52.13,31.09 52.49,30.73 R2.2
$1N3564: length 5.9
  Top Layer w0.254: U2.2 60.33,43.97 60.89,43.41 60.89,40.3 R3.2
$1N3565: length 8.1
  Top Layer w0.254: R4.2 62.42,40.3 62.42,43.66 60.84,45.24 U2.3
$1N3570: length 7.8
  Top Layer w0.254: C13.2 56.45,40.41 56.45,45.82 57.13,46.51 U2.4
$1N5940: length 1.5
  Top Layer w0.6: 21.74,5.01 21.75,5.01 R5.1
$1N5951: length 5.3
  Top Layer w1: P1.1 33.3,56.27 P2.2

## Copper pours and planes (outline as drawn; the poured copper is in the pictures)
3V3 on Top Layer: 33.59,33.76 38.54,33.76 38.54,24.99 33.59,24.99
3V3 on Top Layer: 35.99,29.2 43.62,29.2 43.62,26.69 35.99,26.69
5VIN on Top Layer: 25.25,48.49 41,48.49 41,34.65 25.25,34.65
GND on Top Layer: -3.24,62.71 74.23,62.71 74.23,-2.95 -3.24,-2.95
GND on Bottom Layer: -3.5,62.97 74.35,62.97 74.35,-2.69 -3.5,-2.69
VIN on Top Layer: 38.6,58.07 45.78,58.07 45.78,44.79 38.6,44.79

Small or netless copper shapes (teardrops, artwork), in the pictures only: 137 on Top Layer, 24 on Bottom Layer

## Text on the board
Bottom Silkscreen Layer: PyApple Control
Top Silkscreen Layer: GND | TXD | RXD | 5V | 12 | 11 | 10 | 9 | 8 | 7 | 3V3 | SCL | SDA | 4 | 5 | 3 | 2 | 6 | 1 | - | + | 开关
